# EasyEDA Pro project Pros_touch_weight_sensor-v1.0.0-2023-4-8.eprj, schematic PWS
Create Date: 2023-04-08; Page Name: PWS; Project Name: Pros_touch_weight_sensor-v1.0.0-2023-4-8; Schematic Name: PWS; Update Date: 2023-04-13; Company: SUSTech WYX; Page Size: A4; Version: V1.0
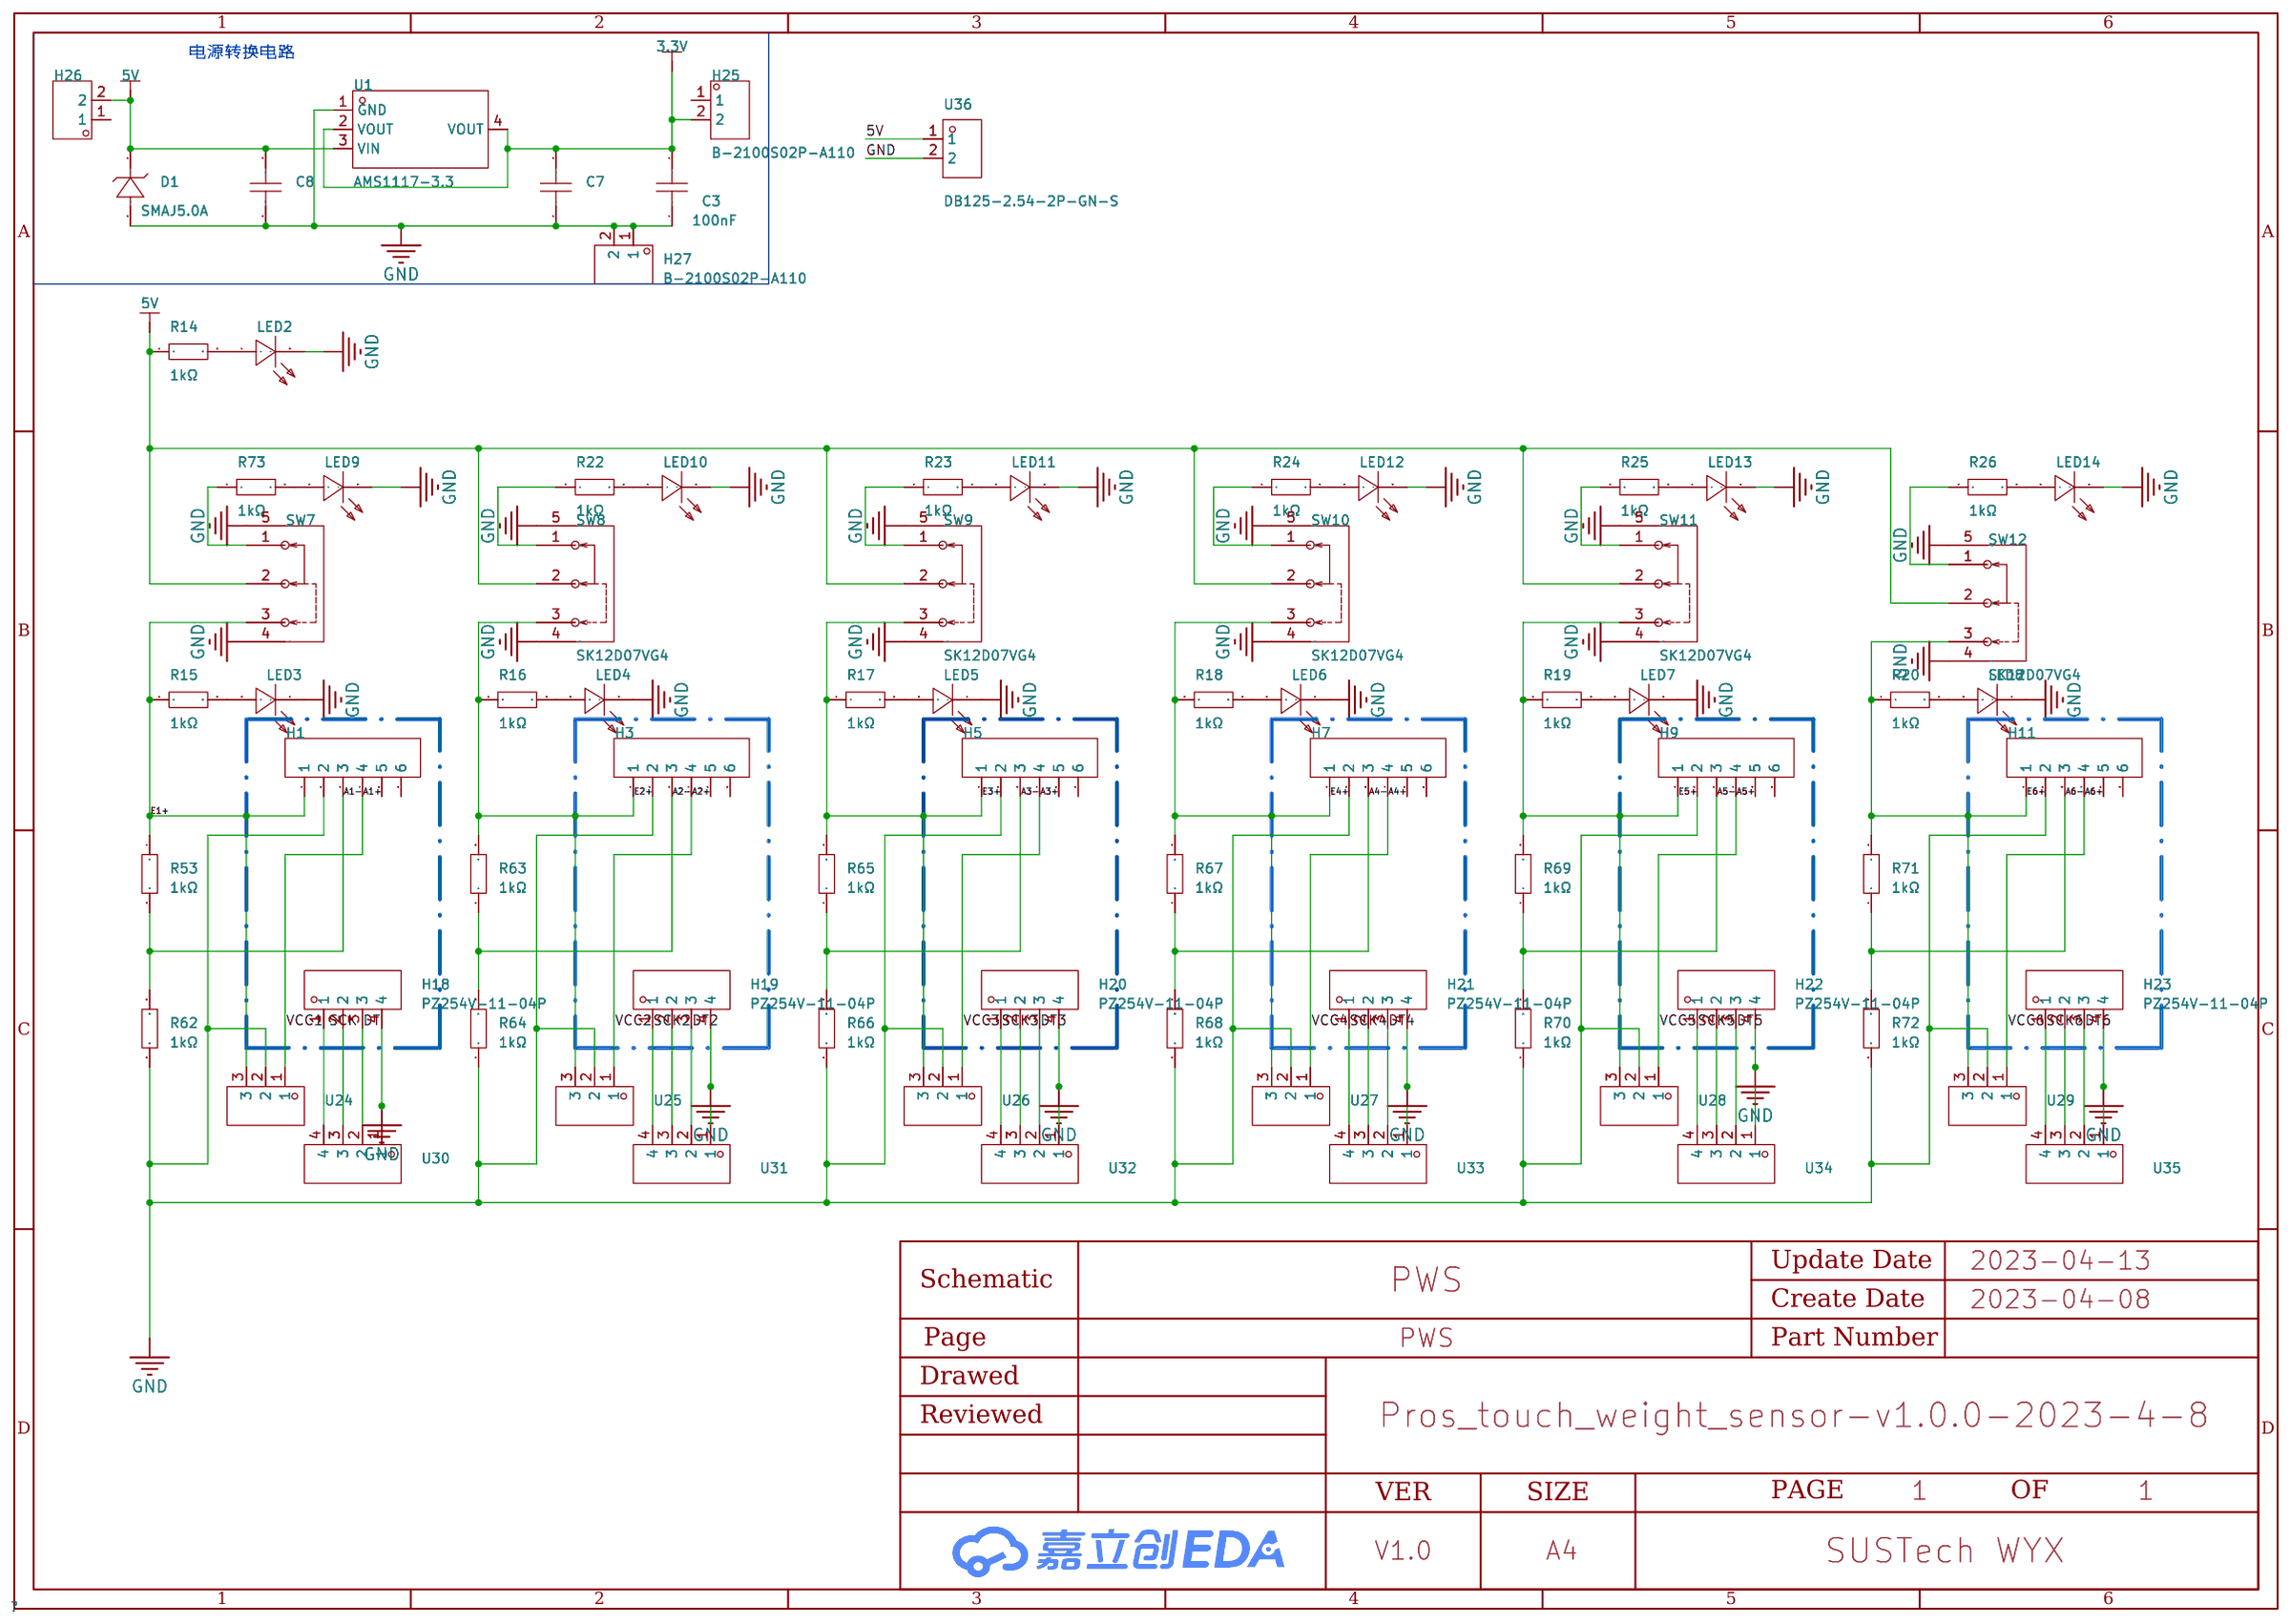
[diagram p0: schematic sheet]

## Parts
C3  100nF  [C0603]
C7  GRM31CC80J476KE01L  [C1206]
C8  GRM31CC80J476KE01L  [C1206]
D1  SMAJ5.0A  [SMA_L4.3-W2.6-LS5.0-RD]
H1  2.54-1x6P直针  [HDR-TH_6P-P2.54-V-M-1]
H3  2.54-1x6P直针  [HDR-TH_6P-P2.54-V-M-1]
H5  2.54-1x6P直针  [HDR-TH_6P-P2.54-V-M-1]
H7  2.54-1x6P直针  [HDR-TH_6P-P2.54-V-M-1]
H9  2.54-1x6P直针  [HDR-TH_6P-P2.54-V-M-1]
H11  2.54-1x6P直针  [HDR-TH_6P-P2.54-V-M-1]
H18  PZ254V-11-04P  [HDR-TH_4P-P2.54-V-M]
H19  PZ254V-11-04P  [HDR-TH_4P-P2.54-V-M]
H20  PZ254V-11-04P  [HDR-TH_4P-P2.54-V-M]
H21  PZ254V-11-04P  [HDR-TH_4P-P2.54-V-M]
H22  PZ254V-11-04P  [HDR-TH_4P-P2.54-V-M]
H23  PZ254V-11-04P  [HDR-TH_4P-P2.54-V-M]
H25  B-2100S02P-A110  [HDR-TH_2P-P2.54-V-M-1]
H26  B-2100S02P-A110  [HDR-TH_2P-P2.54-V-M-1]
H27  B-2100S02P-A110  [HDR-TH_2P-P2.54-V-M-1]
LED2  NCD0805B2  [LED0805-RD]
LED3  NCD1206G1  [LED1206-RD]
LED4  NCD1206G1  [LED1206-RD]
LED5  NCD1206G1  [LED1206-RD]
LED6  NCD1206G1  [LED1206-RD]
LED7  NCD1206G1  [LED1206-RD]
LED8  NCD1206G1  [LED1206-RD]
LED9  NCD0805B2  [LED0805-RD]
LED10  NCD0805B2  [LED0805-RD]
LED11  NCD0805B2  [LED0805-RD]
LED12  NCD0805B2  [LED0805-RD]
LED13  NCD0805B2  [LED0805-RD]
LED14  NCD0805B2  [LED0805-RD]
R14  1kΩ  [R0603]
R15  1kΩ  [R0603]
R16  1kΩ  [R0603]
R17  1kΩ  [R0603]
R18  1kΩ  [R0603]
R19  1kΩ  [R0603]
R20  1kΩ  [R0603]
R22  1kΩ  [R0603]
R23  1kΩ  [R0603]
R24  1kΩ  [R0603]
R25  1kΩ  [R0603]
R26  1kΩ  [R0603]
R53  1kΩ  [R0402]
R62  1kΩ  [R0402]
R63  1kΩ  [R0402]
R64  1kΩ  [R0402]
R65  1kΩ  [R0402]
R66  1kΩ  [R0402]
R67  1kΩ  [R0402]
R68  1kΩ  [R0402]
R69  1kΩ  [R0402]
R70  1kΩ  [R0402]
R71  1kΩ  [R0402]
R72  1kΩ  [R0402]
R73  1kΩ  [R0603]
SW7  SK12D07VG4  [SW-TH_SK12D07VG4]
SW8  SK12D07VG4  [SW-TH_SK12D07VG4]
SW9  SK12D07VG4  [SW-TH_SK12D07VG4]
SW10  SK12D07VG4  [SW-TH_SK12D07VG4]
SW11  SK12D07VG4  [SW-TH_SK12D07VG4]
SW12  SK12D07VG4  [SW-TH_SK12D07VG4]
U1  AMS1117-3.3  [SOT-223-3_L6.5-W3.4-P2.30-LS7.0-BR]
U24  DB125-2.54-3P-GN-S  [CONN-TH_DB125-2.54-3P-GN]
U25  DB125-2.54-3P-GN-S  [CONN-TH_DB125-2.54-3P-GN]
U26  DB125-2.54-3P-GN-S  [CONN-TH_DB125-2.54-3P-GN]
U27  DB125-2.54-3P-GN-S  [CONN-TH_DB125-2.54-3P-GN]
U28  DB125-2.54-3P-GN-S  [CONN-TH_DB125-2.54-3P-GN]
U29  DB125-2.54-3P-GN-S  [CONN-TH_DB125-2.54-3P-GN]
U30  DB125-2.54-4P-GN-S  [CONN-TH_DB125-2.54-4P-GN]
U31  DB125-2.54-4P-GN-S  [CONN-TH_DB125-2.54-4P-GN]
U32  DB125-2.54-4P-GN-S  [CONN-TH_DB125-2.54-4P-GN]
U33  DB125-2.54-4P-GN-S  [CONN-TH_DB125-2.54-4P-GN]
U34  DB125-2.54-4P-GN-S  [CONN-TH_DB125-2.54-4P-GN]
U35  DB125-2.54-4P-GN-S  [CONN-TH_DB125-2.54-4P-GN]
U36  DB125-2.54-2P-GN-S  [CONN-TH_DB125-2.54-2P-GN]

## Library data of the parts
C3 = CC0603KRX7R9BB104: 容值:100nF;精度:±10%;额定电压:50V;材质(温度系数):X7R;; LCSC Part Name: 100nF ±10% 50V; Supplier Part: C14663; Manufacturer: YAGEO(国巨); Supplier Footprint: 0603; JLCPCB Part Class: Basic Part; Datasheet: https://atta.szlcsc.com/upload/public/pdf/source/20180910/C282072_33301C7F631E79921B82A8DAC6BCC5B3.pdf; Supplier: LCSC; Tolerance: ±10%; Voltage Rated: 50V; Temperature Coefficient: X7R
C7 C8 = GRM31CC80J476KE01L: LCSC Part Name: 47uF ±10% 6.3V; Supplier Part: C883601; Manufacturer: muRata(村田); Supplier Footprint: 1206; JLCPCB Part Class: Extended Part; Datasheet: https://atta.szlcsc.com/upload/public/pdf/source/20201027/C883551_458405A74FCB13773427E37ABAEDB4CB.pdf; Supplier: LCSC
D1 = SMAJ5.0A_C908198: 极性:单向;反向截止电压(Vrwm):5V;击穿电压(最小值):6.4V;击穿电压(最大值):7V;反向漏电流(Ir):800μA;峰值脉冲电流(Ipp)@10/1000μs:43.5A;最大钳位电压:9.2V;; LCSC Part Name: 单向 Vrwm:5V; Supplier Part: C908198; Manufacturer: FUXINSEMI(富芯森美); Supplier Footprint: SMA(DO-214AC); JLCPCB Part Class: Extended Part; Datasheet: https://atta.szlcsc.com/upload/public/pdf/source/20201023/C908195_37902766E86D5E1EA357B63C628FE5CE.pdf; Supplier: LCSC; Polarity: 单向; Reverse Stand-Off Voltage (Vrwm): 5V; Breakdown Voltage (Min): 6.4V; Breakdown Voltage (Max): 7V; Reverse Leakage Current (Ir): 800μA; Peak Pulse Current (Ipp)@10/1000μs: 43.5A; Maximum Clamping Voltage: 9.2V
H1 H3 H5 H7 H9 H11 = 2.54-1x6P直针: 排数:单排;总PIN位数:6;间距:2.54mm;插针结构:1x6P;行距:-;安装类型:直插;圆针/方针:方针;额定电流:3A;额定电压:-;配合针长度:-;塑高:-;触头材质:黄铜;触头镀层:-;工作温度范围:-40℃~+105℃;颜色:黑色;; LCSC Part Name: 2.54mm 1x6P 直插 方针; Supplier Part: C37208; Manufacturer: BOOMELE(博穆精密); Supplier Footprint: 直插,P=2.54mm; JLCPCB Part Class: Extended Part; Datasheet: https://atta.szlcsc.com/upload/public/pdf/source/20151109/1457707558014.pdf; Supplier: LCSC; Number of Rows: 单排; Number of Pins: 6; Pitch: 2.54mm; Pin Structure: 1x6P; Mounting Type: 直插; Circluar Pins/Square Pins: 方针; Current Rating (Max): 3A; Contact Material: 黄铜; Operating Temperature Range: -40℃~+105℃; Color: 黑色
H18-H23 = PZ254V-11-04P: 排数:单排;总PIN位数:4;间距:2.54mm;插针结构:1x4P;行距:-;安装类型:直插;圆针/方针:方针;额定电流:3A;额定电压:250V;配合针长度:6mm;塑高:2.5mm;端接针长度:3mm;触头材质:-;工作温度范围:-40℃~+105℃;颜色:黑色;; LCSC Part Name: 2.54mm 1x4P 直插 方针; Supplier Part: C2691448; Manufacturer: XFCN(兴飞); Supplier Footprint: 直插,P=2.54mm; JLCPCB Part Class: Extended Part; Datasheet: https://atta.szlcsc.com/upload/public/pdf/source/20200309/C492403_F9F19131791D08044AD4F84F8E751A34.pdf; Supplier: LCSC; Number of Rows: 单排; Number of Pins: 4; Pitch: 2.54mm; Pin Structure: 1x4P; Mounting Type: 直插; Circluar Pins/Square Pins: 方针; Current Rating (Max): 3A; Voltage Rating (Max): 250V; Length of Mating Pin: 6mm; Insulation Height: 2.5mm; Length of End Connection Pin: 3mm; Operating Temperature Range: -40℃~+105℃; Color: 黑色
H25-H27 = B-2100S02P-A110: 排数:单排;总PIN位数:2;间距:2.54mm;插针结构:1x2P;行距:-;安装类型:直插;圆针/方针:-;额定电流:-;额定电压:-;配合针长度:6mm;塑高:2.54mm;端接针长度:3mm;触头材质:黄铜;触头镀层:-;工作温度范围:-40℃~+105℃;颜色:黑色;; LCSC Part Name: 2.54mm 1x2P 直插; Supplier Part: C124375; Manufacturer: Ckmtw(灿科盟); Supplier Footprint: 插件,P=2.54mm; JLCPCB Part Class: Extended Part; Datasheet: https://atta.szlcsc.com/upload/public/pdf/source/20221019/2EE72DAC61CAA62C0A53546E211F9C15.pdf; Supplier: LCSC; Number of Rows: 单排; Number of Pins: 2; Pitch: 2.54mm; Pin Structure: 1x2P; Mounting Type: 直插; Length of Mating Pin: 6mm; Insulation Height: 2.54mm; Length of End Connection Pin: 3mm; Contact Material: 黄铜; Operating Temperature Range: -40℃~+105℃; Color: 黑色
LED2 LED9-LED14 = NCD0805B2: 照明颜色:蓝色;主波长/色坐标:468~478nm;; LCSC Part Name: 蓝色 0805 贴片LED; Supplier Part: C84259; Manufacturer: 国星光电; Supplier Footprint: 0805; JLCPCB Part Class: Extended Part; Datasheet: https://atta.szlcsc.com/upload/public/pdf/source/20200820/C84259_E5AC6865415989C4C2C2831134BA3A23.pdf; Supplier: LCSC; Mounting Type: 表面贴装; Illumination Color: 蓝色; Luminous Intensity (IF=20mA): 20~55mcd@2mA; Dominant Wavelength / Coordinate rank: 468~478nm
LED3-LED8 = NCD1206G1: 照明颜色:翠绿;色温 - CCT（K）:-;主波长/色坐标:525~530nm;; LCSC Part Name: 翠绿 1206 贴片LED; Supplier Part: C99881; Manufacturer: 国星光电; Supplier Footprint: 1206; JLCPCB Part Class: Extended Part; Datasheet: https://atta.szlcsc.com/upload/public/pdf/source/20200820/C99881_D2C63A8019985C67A0B4713A4EEE83C4.pdf; Supplier: LCSC; Mounting Type: 表面贴装; Illumination Color: 翠绿; Luminous Intensity (IF=20mA): 500~1080mcd; Dominant Wavelength / Coordinate rank: 525~530nm
R14-R20 R22-R26 R73 = 0603WAF1001T5E: 电阻类型:厚膜电阻;阻值:1kΩ;精度:±1%;功率:1/10W;温度系数:±100ppm/℃;最大工作电压:75V;工作温度范围:-55℃~+155℃;; LCSC Part Name: 1kΩ ±1%; Supplier Part: C21190; Manufacturer: UNI-ROYAL(厚声); Supplier Footprint: 0603; JLCPCB Part Class: Basic Part; Datasheet: https://atta.szlcsc.com/upload/public/pdf/source/20200306/C422600_1E6D84923E4A46A82E41ADD87F860B5C.pdf; Supplier: LCSC; Type: 厚膜电阻; Tolerance: ±1%; Power(Watts): 1/10W; Temperature Coefficient: ±100ppm/℃; Overload Voltage (Max): 75V; Operating Temperature Range: -55℃~+155℃
R53 R62-R72 = ERA2AEB102X: 电阻类型:薄膜电阻;阻值:1kΩ;精度:±0.1%;功率:63mW;温度系数:±25ppm/K;最大工作电压:50V;工作温度范围:-55℃~+155℃;; LCSC Part Name: 1kΩ ±0.1% 63mW; Supplier Part: C445596; Manufacturer: PANASONIC(松下); Supplier Footprint: 0402; JLCPCB Part Class: Extended Part; Supplier: LCSC; Type: 薄膜电阻; Tolerance: ±0.1%; Power(Watts): 63mW; Temperature Coefficient: ±25ppm/K; Overload Voltage (Max): 50V; Operating Temperature Range: -55℃~+155℃
SW7-SW12 = SK12D07VG4: 额定电压 DC:50V;触点额定电流:500mA @ 50VDC;电路结构:SPDT;额定电压 AC:-;开关功能:On-On;; LCSC Part Name: 3脚2二档位SK12D07VG4滑动开关1P2T卧式拨动开关; Supplier Part: C393937; Manufacturer: SHOU HAN(首韩); Supplier Footprint: 插件,P=2mm; JLCPCB Part Class: Extended Part; Datasheet: https://atta.szlcsc.com/upload/public/pdf/source/20190521/C393937_939FE26E571CC67D2D532E953108A1B0.pdf; Supplier: LCSC; Operating Force: 130~330gf; Contact Material: Brass; Rated Voltage(DC): 50V; Contact Rating @ Voltage: 500mA @ 50VDC; Circuit: SPDT; Electrical Life Cycles: 5000; Mounting Type: Through Hole, Right Angle; Switch Function: On-On; Switch Height: 4mm; Actuator Orientation: Horizontal; Contact Timing: Shorting (MBB); Termination Style: PC 引脚; Actuator Type: Standard
U1 = AMS1117-3.3_C6186: 输出类型:固定;输出极性:正;最大输入电压:-;输出电压:3.3V;输出电流:1A;电源纹波抑制比(PSRR):72dB@(120Hz);; LCSC Part Name: 正 Vout=3.3V 1A 72dB@(120Hz); Supplier Part: C6186; Manufacturer: AMS; Supplier Footprint: SOT-223; JLCPCB Part Class: Basic Part; Datasheet: https://atta.szlcsc.com/upload/public/pdf/source/20180727/C6186_7A095716F0823C02F1997A905E26C086.pdf; Supplier: LCSC; Output Type: 固定; Output Polarity: 正; Number of Outputs: 1; Output Voltage: 3.3V; Dropout Voltage: 1.3V@(800mA); Output Current: 1A; Power Supply Rejection Ratio (PSRR): 72dB@(120Hz)
U24-U29 = DB125-2.54-3P-GN-S: 间距:2.54mm;排数:1;每排PIN数:3;安装方式:直针;额定电流:8A;额定电压:130V;线规 - AWG:18~26;线规 - mm2:0.5~1;工作温度范围:-40℃~+105℃;颜色:-;; LCSC Part Name: 2.54mm 排数:1 每排P数:3 直针; Supplier Part: C918121; Manufacturer: DIBO(地博电气); Supplier Footprint: 插件,P=2.54mm; JLCPCB Part Class: Extended Part; Datasheet: https://atta.szlcsc.com/upload/public/pdf/source/20230106/BCD3A0BE1EB95DC3E813F1745F022035.pdf; Supplier: LCSC; Pitch: 2.54mm; Number of Rows: 1; Number of PINs Per Row: 3; Mounting Style: 直针; Current Rating (Max): 8A; Voltage Rating (Max): 130V; Wire Gauge - AWG: 18~26; Wire Gauge - mm2: 0.5~1; Operating Temperature Range: -40℃~+105℃
U30-U35 = DB125-2.54-4P-GN-S: 间距:2.54mm;排数:1;每排PIN数:4;安装方式:直针;额定电流:8A;额定电压:130V;线规 - AWG:18~26;线规 - mm2:0.5~1;工作温度范围:-40℃~+105℃;颜色:绿色;; LCSC Part Name: 2.54mm 排数:1 每排P数:4 直针; Supplier Part: C918122; Manufacturer: DIBO(地博电气); Supplier Footprint: 插件,P=2.54mm; JLCPCB Part Class: Extended Part; Datasheet: https://atta.szlcsc.com/upload/public/pdf/source/20230106/BCD3A0BE1EB95DC3E813F1745F022035.pdf; Supplier: LCSC; Pitch: 2.54mm; Number of Rows: 1; Number of PINs Per Row: 4; Mounting Style: 直针; Current Rating (Max): 8A; Voltage Rating (Max): 130V; Wire Gauge - AWG: 18~26; Wire Gauge - mm2: 0.5~1; Operating Temperature Range: -40℃~+105℃; Color: 绿色
U36 = DB125-2.54-2P-GN-S: 间距:2.54mm;排数:1;每排PIN数:2;安装方式:直针;额定电流:8A;额定电压:130V;线规 - AWG:18~26;线规 - mm?:0.5~1;工作温度范围:-40℃~+105℃;颜色:绿色;; LCSC Part Name: 2.54mm 排数:1 每排P数:2 直针; Supplier Part: C918120; Manufacturer: DIBO(地博电气); Supplier Footprint: 直插,P=2.54mm; JLCPCB Part Class: Extended Part; Datasheet: https://atta.szlcsc.com/upload/public/pdf/source/20201111/C918120_C9DB7F6F3DB366529A80D61CABEEDAE6.pdf; Supplier: LCSC; Pitch: 2.54mm; Number of Rows: 1; Number of PINs Per Row: 2; Mounting Style: 直针; Current Rating (Max): 8A; Voltage Rating (Max): 130V; Wire Gauge - AWG: 18~26; Wire Gauge - mm?: 0.5~1; Operating Temperature Range: -40℃~+105℃; Color: 绿色

## Nets
3.3V: C3.2 C7.2 H25.2 U1.2(VOUT) U1.4(VOUT)
5V: C8.2 D1.1(C) H26.2 R14.1 SW7.2 SW8.2 SW9.2 SW10.2 SW11.2 SW12.2 U1.3(VIN) U36.1
GND: C3.1 C7.1 C8.1 D1.2(A) H1.2 H3.2 H5.2 H7.2 H9.2 H11.2 H18.4 H19.4 H20.4 H21.4 H22.4 H23.4 H27.1 H27.2 LED2.2(-) LED3.1(-) LED4.1(-) LED5.1(-) LED6.1(-) LED7.1(-) LED8.1(-) LED9.2(-) LED10.2(-) LED11.2(-) LED12.2(-) LED13.2(-) LED14.2(-) R62.1 R64.1 R66.1 R68.1 R70.1 R72.1 SW7.4 SW7.5 SW8.4 SW8.5 SW9.4 SW9.5 SW10.4 SW10.5 SW11.4 SW11.5 SW12.4 SW12.5 U1.1(GND) U24.2 U25.2 U26.2 U27.2 U28.2 U29.2 U30.1 U31.1 U32.1 U33.1 U34.1 U35.1 U36.2
VCC1: H18.1 U30.4
VCC2: H19.1 U31.4
VCC3: H20.1 U32.4
VCC4: H21.1 U33.4
VCC5: H22.1 U34.4
VCC6: H23.1 U35.4
A1+: H1.4 U24.1
A1-: H1.3 R53.2 R62.2
A2+: H3.4 U25.1
A2-: H3.3 R63.1 R64.2
A3+: H5.4 U26.1
A3-: H5.3 R65.1 R66.2
A4+: H7.4 U27.1
A4-: H7.3 R67.1 R68.2
A5+: H9.4 U28.1
A5-: H9.3 R69.1 R70.2
A6+: H11.4 U29.1
A6-: H11.3 R71.1 R72.2
DT: H18.3 U30.2
DT2: H19.3 U31.2
DT3: H20.3 U32.2
DT4: H21.3 U33.2
DT5: H22.3 U34.2
DT6: H23.3 U35.2
E1+: H1.1 R15.1 R53.1 SW7.3 U24.3
E2+: H3.1 R16.1 R63.2 SW8.3 U25.3
E3+: H5.1 R17.1 R65.2 SW9.3 U26.3
E4+: H7.1 R18.1 R67.2 SW10.3 U27.3
E5+: H9.1 R19.1 R69.2 SW11.3 U28.3
E6+: H11.1 R20.1 R71.2 SW12.3 U29.3
SCK: H18.2 U30.3
SCK2: H19.2 U31.3
SCK3: H20.2 U32.3
SCK4: H21.2 U33.3
SCK5: H22.2 U34.3
SCK6: H23.2 U35.3
$1N6996: LED2.1(+) R14.2
$1N8106: LED4.2(+) R16.2
$1N8147: LED5.2(+) R17.2
$1N8185: LED6.2(+) R18.2
$1N8223: LED7.2(+) R19.2
$1N8261: LED8.2(+) R20.2
$1N8986: LED10.1(+) R22.2
$1N9065: LED11.1(+) R23.2
$1N9144: LED12.1(+) R24.2
$1N9223: LED13.1(+) R25.2
$1N9302: LED14.1(+) R26.2
$1N21279: R73.1 SW7.1
$1N21286: R22.1 SW8.1
$1N21297: R23.1 SW9.1
$1N21310: R24.1 SW10.1
$1N21323: R25.1 SW11.1
$1N21338: R26.1 SW12.1
$1N24564: LED3.2(+) R15.2
$1N24602: LED9.1(+) R73.2

Not connected (* = marked no-connect by the designer): H1 5 6; H3 5 6; H5 5 6; H7 5 6; H9 5 6; H11 5 6; H25 1; H26 1

## Notes on the sheet
- 电源转换电路
